# Altium project AP.PrjPcb
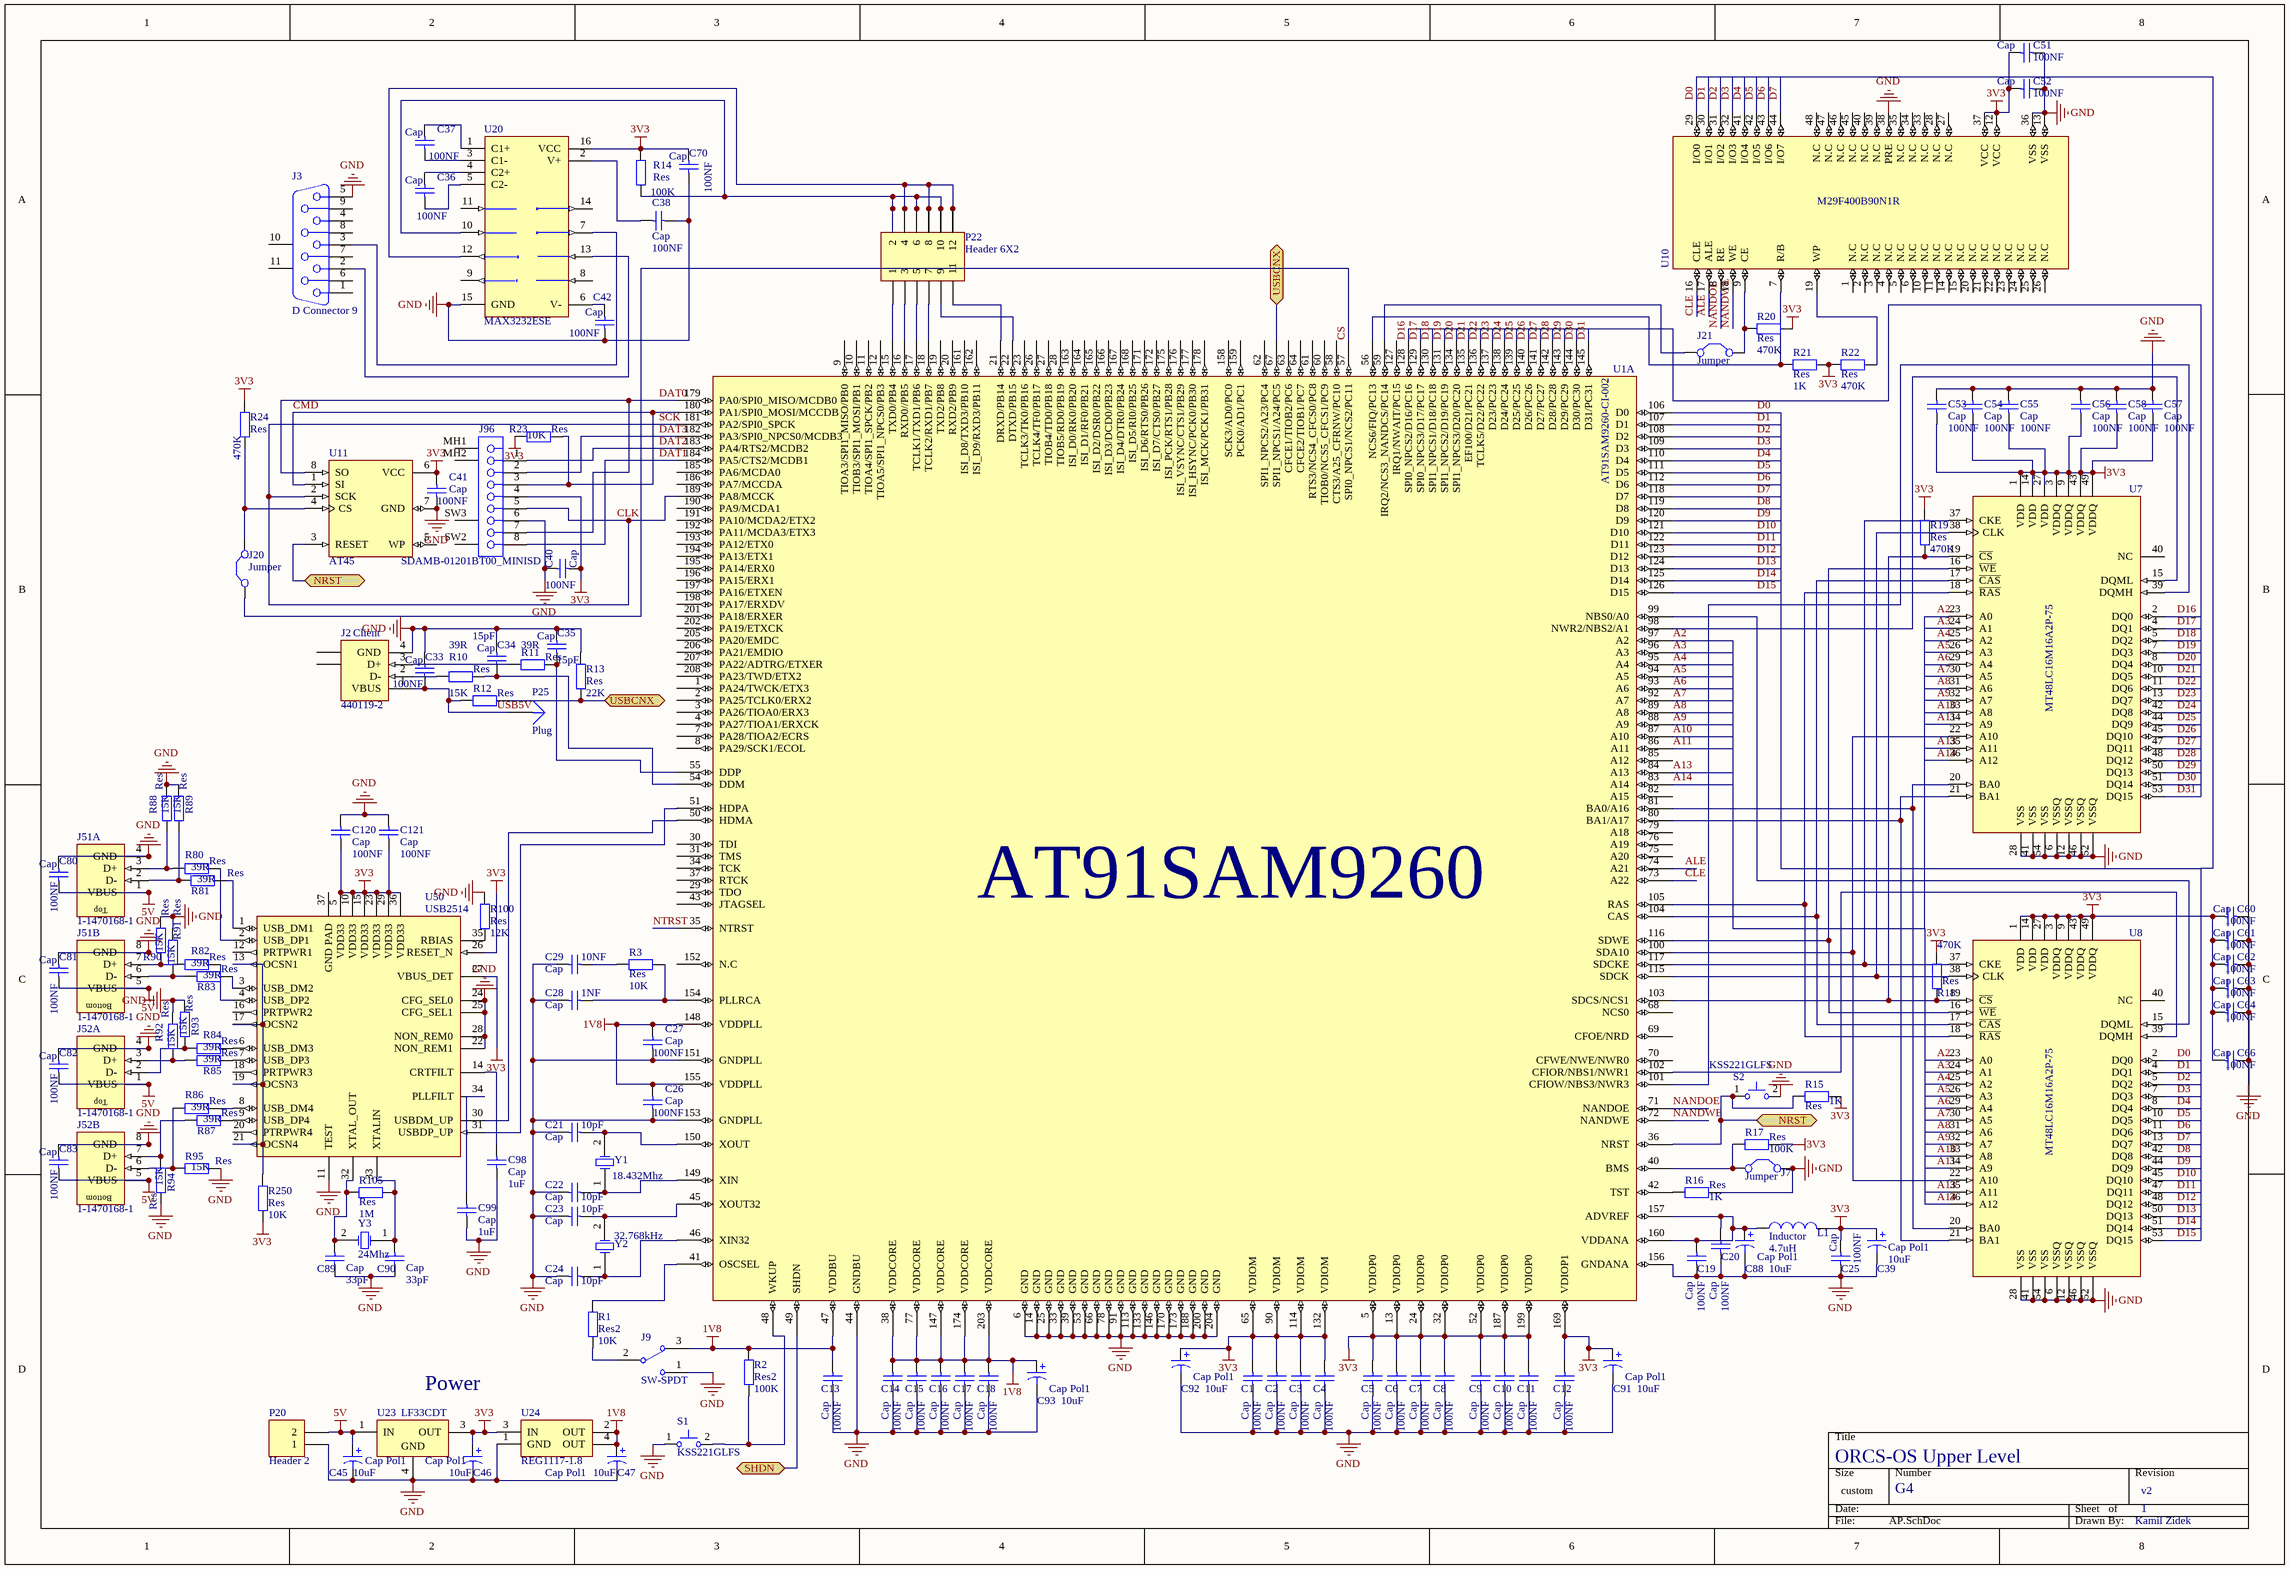
[diagram p0: AP.SchDoc]
1 sheet, 135 parts. Net scope: flat (ports and power ports of the same name join across sheets).
Board file: AP.PcbDoc

## Sheet AP.SchDoc
size 482 x 330 mm; PageSetup: Record=PageOptions|CenterHorizontal=True|CenterVertical=True|PrintScale=2.71|XCorrection=1.00|YCorrection=1.00|PrintKind=1|BorderSize=5000000|LeftOffset=0|BottomOffset=0|Orientation=2|PaperLength=1000|PaperWidth=1000|Scale=100|PaperSource=1|PrintQuality=600|MediaType=1|DitherType=10|PaperKind=Letter|PrintScaleMode=1

### Parts
C1  Cap  value 100NF  [C0805]
C2  Cap  value 100NF  [C0805]
C3  Cap  value 100NF  [C0805]
C4  Cap  value 100NF  [C0805]
C5  Cap  value 100NF  [C0805]
C6  Cap  value 100NF  [C0805]
C7  Cap  value 100NF  [C0805]
C8  Cap  value 100NF  [C0805]
C9  Cap  value 100NF  [C0805]
C10  Cap  value 100NF  [C0805]
C11  Cap  value 100NF  [C0805]
C12  Cap  value 100NF  [C0805]
C13  Cap  value 100NF  [C0805]
C14  Cap  value 100NF  [C0805]
C15  Cap  value 100NF  [C0805]
C16  Cap  value 100NF  [C0805]
C17  Cap  value 100NF  [C0805]
C18  Cap  value 100NF  [C0805]
C19  Cap  value 100NF  [C0805]
C20  Cap  value 100NF  [C0805]
C21  Cap  value 10pF  [C0805]
C22  Cap  value 10pF  [C0805]
C23  Cap  value 10pF  [C0805]
C24  Cap  value 10pF  [C0805]
C25  Cap  value 100NF  [C0805]
C26  Cap  value 100NF  [C0805]
C27  Cap  value 100NF  [C0805]
C28  Cap  value 1NF  [C0805]
C29  Cap  value 10NF  [C0805]
C33  Cap  value 100NF  [C0805]
C34  Cap  value 15pF  [C0805]
C35  Cap  value 15pF  [C0805]
C36  Cap  value 100NF  [C0805]
C37  Cap  value 100NF  [C0805]
C38  Cap  value 100NF  [C0805]
C39  Cap Pol1  value 10uF  [A]
C40  Cap  value 100NF  [C0805]
C41  Cap  value 100NF  [C0805]
C42  Cap  value 100NF  [C0805]
C45  Cap Pol1  value 10uF  [A]
C46  Cap Pol1  value 10uF  [A]
C47  Cap Pol1  value 10uF  [A]
C51  Cap  value 100NF  [C0805]
C52  Cap  value 100NF  [C0805]
C53  Cap  value 100NF  [C0805]
C54  Cap  value 100NF  [C0805]
C55  Cap  value 100NF  [C0805]
C56  Cap  value 100NF  [C0805]
C57  Cap  value 100NF  [C0805]
C58  Cap  value 100NF  [C0805]
C60  Cap  value 100NF  [C0805]
C61  Cap  value 100NF  [C0805]
C62  Cap  value 100NF  [C0805]
C63  Cap  value 100NF  [C0805]
C64  Cap  value 100NF  [C0805]
C66  Cap  value 100NF  [C0805]
C70  Cap  value 100NF  [C0805]
C80  Cap  value 100NF  [C0805]
C81  Cap  value 100NF  [C0805]
C82  Cap  value 100NF  [C0805]
C83  Cap  value 100NF  [C0805]
C88  Cap Pol1  value 10uF  [A]
C89  Cap  value 33pF  [C0805]
C90  Cap  value 33pF  [C0805]
C91  Cap Pol1  value 10uF  [A]
C92  Cap Pol1  value 10uF  [A]
C93  Cap Pol1  value 10uF  [A]
C98  Cap  value 1uF  [C0805]
C99  Cap  value 1uF  [C0805]
C120  Cap  value 100NF  [C0805]
C121  Cap  value 100NF  [C0805]
J2  440119-2  [440247]
J3  D Connector 9  [DSUB1.385-2H9]
J7  Jumper  [RAD-0.2]
J9  SW-SPDT  [TL36WW15050]
J20  Jumper  [RAD-0.2]
J21  Jumper  [RAD-0.2]
J51  1-1470168-1  [1470168]  (parts A,B of 3)
J52  1-1470168-1  [1470168]  (parts A,B of 3)
J96  SDAMB-01201BT00_MINISD  [SDAMB-012_miniSD]
L1  Inductor  value 4.7uH  [0402-A]
P20  Header 2  [HDR1X2]
P22  Header 6X2  [HDR2X6]
P25  Plug  [PIN1]
R1  Res2  value 10K  [2012[0805]]
R2  Res2  value 100K  [2012[0805]]
R3  Res  value 10K  [2012[0805]]
R10  Res  value 39R  [2012[0805]]
R11  Res  value 39R  [2012[0805]]
R12  Res  value 15K  [2012[0805]]
R13  Res  value 22K  [2012[0805]]
R14  Res  value 100K  [2012[0805]]
R15  Res  value 1K  [2012[0805]]
R16  Res  value 1K  [2012[0805]]
R17  Res  value 100K  [2012[0805]]
R18  Res  value 470K  [2012[0805]]
R19  Res  value 470K  [2012[0805]]
R20  Res  value 470K  [2012[0805]]
R21  Res  value 1K  [2012[0805]]
R22  Res  value 470K  [2012[0805]]
R23  Res  value 10K  [2012[0805]]
R24  Res  value 470K  [2012[0805]]
R80  Res  value 39R  [2012[0805]]
R81  Res  value 39R  [2012[0805]]
R82  Res  value 39R  [2012[0805]]
R83  Res  value 39R  [2012[0805]]
R84  Res  value 39R  [2012[0805]]
R85  Res  value 39R  [2012[0805]]
R86  Res  value 39R  [2012[0805]]
R87  Res  value 39R  [2012[0805]]
R88  Res  value 15K  [2012[0805]]
R89  Res  value 15K  [2012[0805]]
R90  Res  value 15K  [2012[0805]]
R91  Res  value 15K  [2012[0805]]
R92  Res  value 15K  [2012[0805]]
R93  Res  value 15K  [2012[0805]]
R94  Res  value 15K  [2012[0805]]
R95  Res  value 15K  [2012[0805]]
R100  Res  value 12K  [2012[0805]]
R105  Res  value 1M  [2012[0805]]
R250  Res  value 10K  [2012[0805]]
S1  KSS221GLFS  [KSS-2G]
S2  KSS221GLFS  [KSS-2G]
U1  AT91SAM9260-CI-002  [QFP208_M]  (part A of 3)
U7  MT48LC16M16A2P-75  [TSOP2-54_L]
U8  MT48LC16M16A2P-75  [TSOP2-54_L]
U10  M29F400B90N1R  [TSOP48]
U11  AT45  [SO8W_N]
U20  MAX3232ESE  [NSO16_N]
U23  LF33CDT  [TO-252]
U24  REG1117-1.8  [ZZ311]
U50  USB2514  [QFN36_L]
Y1  18.432Mhz  [HC-49U]
Y2  32.768kHz  [R38]
Y3  24Mhz  [HC-49U]

### Ports
NRST, SHDN, USBCNX

### Nets
1V8: C13.2 C14.2 C15.2 C16.2 C17.2 C18.2 C26.1 C27.1 C47.1 C93.1 J9.3 R2.2 U1.38(VDDCORE) U1.47(VDDBU) U1.77(VDDCORE) U1.147(VDDCORE) U1.148(VDDPLL) U1.155(VDDPLL) U1.174(VDDCORE) U1.203(VDDCORE) U24.2(OUT) U24.4(OUT)
3V3: C1.2 C2.2 C3.2 C4.2 C5.2 C6.2 C7.2 C8.2 C9.2 C10.2 C11.2 C12.2 C25.2 C39.1 C40.1 C41.1 C46.1 C51.2 C52.2 C53.2 C54.2 C55.2 C56.2 C57.2 C58.2 C60.1 C61.1 C62.1 C63.1 C64.1 C66.1 C70.2 C91.1 C92.1 C120.1 C121.2 J96.4 L1.2 R14.2 R15.1 R17.1 R18.1 R19.1 R20.2 R21.2 R22.1 R23.2 R24.1 R250.2 U1.5(VDIOP0) U1.13(VDIOP0) U1.24(VDIOP0) U1.32(VDIOP0) U1.52(VDIOP0) U1.65(VDIOM) U1.90(VDIOM) U1.114(VDIOM) U1.132(VDIOM) U1.169(VDIOP1) U1.187(VDIOP0) U1.199(VDIOP0) U7.1(VDD) U7.3(VDDQ) U7.9(VDDQ) U7.14(VDD) U7.27(VDD) U7.43(VDDQ) U7.49(VDDQ) U8.1(VDD) U8.3(VDDQ) U8.9(VDDQ) U8.14(VDD) U8.27(VDD) U8.43(VDDQ) U8.49(VDDQ) U10.12(VCC) U10.37(VCC) U11.6(VCC) U20.16(VCC) U23.3(OUT) U24.3(IN) U50.5(VDD33) U50.10(VDD33) U50.15(VDD33) U50.23(VDD33) U50.26(RESET_N) U50.27(VBUS_DET) U50.29(VDD33) U50.36(VDD33)
5V: C45.1 C80.1 C81.1 C82.1 C83.1 J51.1(VBUS) J51.5(VBUS) J52.1(VBUS) J52.5(VBUS) P20.2 U23.1(IN)
GND: C1.1 C2.1 C3.1 C4.1 C5.1 C6.1 C7.1 C8.1 C9.1 C10.1 C11.1 C12.1 C13.1 C14.1 C15.1 C16.1 C17.1 C18.1 C19.1 C20.1 C21.2 C22.2 C23.2 C24.2 C25.1 C26.2 C27.2 C28.2 C29.2 C33.2 C34.2 C35.2 C38.1 C39.2 C40.2 C41.2 C42.1 C45.2 C46.2 C47.2 C51.1 C52.1 C53.1 C54.1 C55.1 C56.1 C57.1 C58.1 C60.2 C61.2 C62.2 C63.2 C64.2 C66.2 C70.1 C80.2 C81.2 C82.2 C83.2 C88.2 C89.2 C90.2 C91.2 C92.2 C93.2 C98.2 C99.2 C120.2 C121.1 J2.4(GND) J3.5 J7.2(C2) J9.1 J51.4(GND) J51.8(GND) J52.4(GND) J52.8(GND) J96.6 P20.1 R13.2 R16.1 R88.2 R89.1 R90.2 R91.2 R92.2 R93.2 R94.1 R95.1 R100.2 S1.1 S2.2 U1.6(GND) U1.14(GND) U1.25(GND) U1.33(GND) U1.39(GND) U1.44(GNDBU) U1.53(GND) U1.66(GND) U1.78(GND) U1.91(GND) U1.113(GND) U1.133(GND) U1.146(GND) U1.151(GNDPLL) U1.153(GNDPLL) U1.156(GNDANA) U1.170(GND) U1.173(GND) U1.188(GND) U1.200(GND) U1.204(GND) U7.6(VSSQ) U7.12(VSSQ) U7.28(VSS) U7.41(VSS) U7.46(VSSQ) U7.52(VSSQ) U7.54(VSS) U8.6(VSSQ) U8.12(VSSQ) U8.28(VSS) U8.41(VSS) U8.46(VSSQ) U8.52(VSSQ) U8.54(VSS) U10.13(VSS) U10.36(VSS) U10.38(PRE) U11.7(GND) U20.15(GND) U23.4(GND) U24.1(GND) U50.11(TEST) U50.22(NON_REM1) U50.24(CFG_SEL0) U50.25(CFG_SEL1) U50.28(NON_REM0)
A2: U1.97(A2) U7.23(A0) U8.23(A0)
A3: U1.96(A3) U7.24(A1) U8.24(A1)
A4: U1.95(A4) U7.25(A2) U8.25(A2)
A5: U1.94(A5) U7.26(A3) U8.26(A3)
A6: U1.93(A6) U7.29(A4) U8.29(A4)
A7: U1.92(A7) U7.30(A5) U8.30(A5)
A8: U1.89(A8) U7.31(A6) U8.31(A6)
A9: U1.88(A9) U7.32(A7) U8.32(A7)
A10: U1.87(A10) U7.33(A8) U8.33(A8)
A11: U1.86(A11) U7.34(A9) U8.34(A9)
A13: U1.84(A13) U7.35(A11) U8.35(A11)
A14: U1.83(A14) U7.36(A12) U8.36(A12)
ALE: U1.74(A21) U10.17(ALE)
CLE: U1.73(A22) U10.16(CLE)
CLK: J96.5 U1.181(PA2/SPI0_SPCK) U1.189(PA8/MCCK) U11.2(SCK)  [also labelled SCK]
CMD: J96.3 R23.1 U1.180(PA1/SPI0_MOSI/MCCDB) U11.1(SI)
CS: J20.1(C1) U1.57(SPI0_NPCS1/NCS2/PC11)
D0: U1.106(D0) U8.2(DQ0) U10.29(I/O0)
D1: U1.107(D1) U8.4(DQ1) U10.30(I/O1)
D2: U1.108(D2) U8.5(DQ2) U10.31(I/O2)
D3: U1.109(D3) U8.7(DQ3) U10.32(I/O3)
D4: U1.110(D4) U8.8(DQ4) U10.41(I/O4)
D5: U1.111(D5) U8.10(DQ5) U10.42(I/O5)
D6: U1.112(D6) U8.11(DQ6) U10.43(I/O6)
D7: U1.118(D7) U8.13(DQ7) U10.44(I/O7)
D8: U1.119(D8) U8.42(DQ8)
D9: U1.120(D9) U8.44(DQ9)
D10: U1.121(D10) U8.45(DQ10)
D11: U1.122(D11) U8.47(DQ11)
D12: U1.123(D12) U8.48(DQ12)
D13: U1.124(D13) U8.50(DQ13)
D14: U1.125(D14) U8.51(DQ14)
D15: U1.126(D15) U8.53(DQ15)
D16: U1.128(SPI0_NPCS2/D16/PC16) U7.2(DQ0)
D17: U1.129(SPI0_NPCS3/D17/PC17) U7.4(DQ1)
D18: U1.130(SPI1_NPCS1/D18/PC18) U7.5(DQ2)
D19: U1.131(SPI1_NPCS2/D19/PC19) U7.7(DQ3)
D20: U1.134(SPI1_NPCS3/D20/PC20) U7.8(DQ4)
D21: U1.135(EF100/D21/PC21) U7.10(DQ5)
D22: U1.136(TCLK5/D22/PC22) U7.11(DQ6)
D23: U1.137(D23/PC23) U7.13(DQ7)
D24: U1.138(D24/PC24) U7.42(DQ8)
D25: U1.139(D25/PC25) U7.44(DQ9)
D26: U1.140(D26/PC26) U7.45(DQ10)
D27: U1.141(D27/PC27) U7.47(DQ11)
D28: U1.142(D28/PC28) U7.48(DQ12)
D29: U1.143(D29/PC29) U7.50(DQ13)
D30: U1.144(D30/PC30) U7.51(DQ14)
D31: U1.145(D31/PC31) U7.53(DQ15)
DAT0: J96.7 U1.179(PA0/SPI0_MISO/MCDB0) U11.8(SO)
DAT1: J96.8 U1.184(PA5/CTS2/MCDB1)
DAT2: J96.1 U1.183(PA4/RTS2/MCDB2)
DAT3: J96.2 U1.182(PA3/SPI0_NPCS0/MCDB3)
NANDOE: U1.71(NANDOE) U10.8(RE)
NANDWE: U1.72(NANDWE) U10.18(WE)
NTRST: U1.35(NTRST)
USB5V: C33.1 J2.1(VBUS) P25.1 R12.2
NetC19_2: C19.2 C20.2 C88.1 L1.1 U1.157(ADVREF) U1.160(VDDANA)
NetC21_1: C21.1 U1.150(XOUT) Y1.2(OSC2)
NetC22_1: C22.1 U1.149(XIN) Y1.1(OSC1)
NetC23_1: C23.1 U1.45(XOUT32) Y2.2(OSC2)
NetC24_1: C24.1 U1.46(XIN32) Y2.1(OSC1)
NetC28_1: C28.1 R3.1 U1.154(PLLRCA)
NetC29_1: C29.1 R3.2
NetC34_1: C34.1 R10.1 U1.54(DDM)
NetC35_1: C35.1 R11.1 U1.55(DDP)
NetC36_1: C36.1 U20.5(C2-)
NetC36_2: C36.2 U20.4(C2+)
NetC37_1: C37.1 U20.3(C1-)
NetC37_2: C37.2 U20.1(C1+)
NetC38_2: C38.2 U20.2(V+)
NetC42_2: C42.2 U20.6(V-)
NetC89_1: C89.1 R105.2 U50.32(XTAL_OUT) Y3.2(OSC2)
NetC90_1: C90.1 R105.1 U50.33(XTALIN) Y3.1(OSC1)
NetC98_1: C98.1 U50.14(CRTFILT)
NetC99_1: C99.1 U50.34(PLLFILT)
NetJ2_2: J2.2(D-) R10.2
NetJ2_3: J2.3(D+) R11.2
NetJ3_2: J3.2 U20.13(R1IN)
NetJ3_3: J3.3 U20.7(T2OUT)
NetJ7_1: J7.1(C1) R17.2 U1.40(BMS)
NetJ9_2: J9.2 R1.1
NetJ20_2: J20.2(C2) R24.2 U11.4(CS)
NetJ21_1: J21.1(C1) U1.59(IRQ2/NCS3_NANDCS/PC14)
NetJ21_2: J21.2(C2) R20.1 U10.9(CE)
NetJ51_2: J51.2(D-) R81.2 R89.2
NetJ51_3: J51.3(D+) R80.2 R88.1
NetJ51_6: J51.6(D-) R83.2 R90.1
NetJ51_7: J51.7(D+) R82.2 R91.1
NetJ52_2: J52.2(D-) R84.2 R93.1
NetJ52_3: J52.3(D+) R85.2 R92.1
NetJ52_6: J52.6(D-) R86.2 R95.2
NetJ52_7: J52.7(D+) R87.2 R94.2
NetP22_1: P22.1 U1.15(TXD0/PB4)
NetP22_2: P22.2 P22.6 P22.10 R14.1 U20.10(T2IN)
NetP22_3: P22.3 U1.16(RXD0//PB5)
NetP22_4: P22.4 P22.8 P22.12 U20.12(R1OUT)
NetP22_5: P22.5 U1.17(TCLK1/TXD1/PB6)
NetP22_7: P22.7 U1.18(TCLK2/RXD1/PB7)
NetP22_9: P22.9 U1.22(DTXD/PB15)
NetP22_11: P22.11 U1.21(DRXD/PB14)
NetR1_2: R1.2 U1.41(OSCSEL)
NetR2_1: R2.1 S1.2 U1.48(WKUP)
NetR12_1: R12.1 R13.1 U1.67(SPI1_NPCS1/A24/PC5) ; port USBCNX
NetR15_2: R15.2 S2.1 U1.36(NRST) U11.3(RESET) ; port NRST
NetR16_2: R16.2 U1.42(TST)
NetR18_2: R18.2 R19.2 U1.103(SDCS/NCS1) U7.19(~{CS}) U8.19(~{CS})
NetR21_1: R21.1 U1.56(NCS6/FIQ/PC13) U10.7(R/B)
NetR22_2: R22.2 U10.19(WP)
NetR80_1: R80.1 U50.2(USB_DP1)
NetR81_1: R81.1 U50.1(USB_DM1)
NetR82_1: R82.1 U50.4(USB_DP2)
NetR83_1: R83.1 U50.3(USB_DM2)
NetR84_1: R84.1 U50.6(USB_DM3)
NetR85_1: R85.1 U50.7(USB_DP3)
NetR86_1: R86.1 U50.8(USB_DM4)
NetR87_1: R87.1 U50.9(USB_DP4)
NetR100_1: R100.1 U50.35(RBIAS)
NetR250_1: R250.1 U50.13(OCSN1) U50.17(OCSN2) U50.19(OCSN3) U50.21(OCSN4)
NetU1_49: U1.49(SHDN) ; port SHDN
NetU1_50: U1.50(HDMA) U50.30(USBDM_UP)
NetU1_51: U1.51(HDPA) U50.31(USBDP_UP)
NetU1_80: U1.80(BA1/A17) U7.21(BA1) U8.21(BA1)
NetU1_81: U1.81(BA0/A16) U7.20(BA0) U8.20(BA0)
NetU1_98: U1.98(NWR2/NBS2/A1) U7.15(DQML)
NetU1_99: U1.99(NBS0/A0) U8.15(DQML)
NetU1_100: U1.100(SDA10) U7.22(A10) U8.22(A10)
NetU1_101: U1.101(CFIOW/NBS3/NWR3) U7.39(DQMH)
NetU1_102: U1.102(CFIOR/NBS1/NWR1) U8.39(DQMH)
NetU1_104: U1.104(CAS) U7.17(~{CAS}) U8.17(~{CAS})
NetU1_105: U1.105(RAS) U7.18(~{RAS}) U8.18(~{RAS})
NetU1_115: U1.115(SDCK) U7.38(CLK) U8.38(CLK)
NetU1_116: U1.116(SDWE) U7.16(~{WE}) U8.16(~{WE})
NetU1_117: U1.117(SDCKE) U7.37(CKE) U8.37(CKE)

Not connected (* = marked no-connect by the designer): J2 5(SHLD) 6(SHLD); J3 1 4 6 7 8 9 10(MH1) 11(MH2); J96 MH1 MH2 SW2 SW3; U1 1(PA24/TWCK/ETX3) 2(PA25/TCLK0/ERX2) 3(PA26/TIOA0/ERX3) 4(PA27/TIOA1/ERXCK) 7(PA28/TIOA2/ECRS) 8(PA29/SCK1/ECOL) 9(TIOA3/SPI1_MISO/PB0) 10(TIOB3/SPI1_MOSI/PB1) 11(TIOA4/SPI1_SPCK/PB2) 12(TIOA5/SPI1_NPCS0/PB3) 19(TXD2/PB8) 20(RXD2/PB9) 23(TCLK3/TK0/PB16) 26(TCLK4/TF0/PB17) 27(TIOB4/TD0/PB18) 28(TIOB5/RD0/PB19) 29(TDO) 30(TDI) 31(TMS) 34(TCK) 37(RTCK) 43(JTAGSEL) 58(CTS3/A25_CFRNW/PC10) 60(TIOB0/NCS5_CFCS1/PC9) 61(RTS3/NCS4_CFCS0/PC8) 62(SPI1_NPCS2/A23/PC4) 63(CFCE1/TIOB2/PC6) 64(CFCE2/TIOB1/PC7) 68(NCS0) 69(CFOE/NRD) 70(CFWE/NWE/NWR0) 75(A20) 76(A19) 79(A18) 82(A15) 85(A12) 127(IRQ1/NWAIT/PC15) 152(N.C) 158(SCK3/AD0/PC0) 159(PCK0/AD1/PC1) 161(ISI_D8/TXD3/PB10) 162(ISI_D9/RXD3/PB11) 163(ISI_D0/RK0/PB20) 164(ISI_D1/RF0/PB21) 165(ISI_D2/DSR0/PB22) 166(ISI_D3/DCD0/PB23) 167(ISI_D4/DTR0/PB24) 168(ISI_D5/RI0/PB25) 171(ISI_D6/RTS0/PB26) 172(ISI_D7/CTS0/PB27) 175(ISI_PCK/RTS1/PB28) 176(ISI_VSYNC/CTS1/PB29) 177(ISI_HSYNC/PCK0/PB30) 178(ISI_MCK/PCK1/PB31) 185(PA6/MCDA0) 186(PA7/MCCDA) 190(PA9/MCDA1) 191(PA10/MCDA2/ETX2) 192(PA11/MCDA3/ETX3) 193(PA12/ETX0) 194(PA13/ETX1) 195(PA14/ERX0) 196(PA15/ERX1) 197(PA16/ETXEN) 198(PA17/ERXDV) 201(PA18/ERXER) 202(PA19/ETXCK) 205(PA20/EMDC) 206(PA21/EMDIO) 207(PA22/ADTRG/ETXER) 208(PA23/TWD/ETX2); U7 40(NC); U8 40(NC); U10 1(N.C) 2(N.C) 3(N.C) 4(N.C) 5(N.C) 6(N.C) 10(N.C) 11(N.C) 14(N.C) 15(N.C) 20(N.C) 21(N.C) 22(N.C) 23(N.C) 24(N.C) 25(N.C) 26(N.C) 27(N.C) 28(N.C) 33(N.C) 34(N.C) 35(N.C) 39(N.C) 40(N.C) 45(N.C) 46(N.C) 47(N.C) 48(N.C); U11 5(WP); U20 8(R2IN) 9(R2OUT) 11(T1IN) 14(T1OUT); U50 12(PRTPWR1) 16(PRTPWR2) 18(PRTPWR3) 20(PTRPWR4) 37(GND_PAD)

### Notes on the sheet
- (near J2) Client
- Power
- ORCS-OS Upper Level
- G4
- Kamil Zidek
- 1
- v2
- (in symbol 1-1470168-1, part A) Top
- (in symbol 1-1470168-1, part B) Bottom
- (in symbol AT91RM9200-CI-002, part A) AT91SAM9260

### Library data of the parts
C1-C29 C33-C38 C40-C42 C51-C58 C60-C64 C66 C70 C80-C83 C89 C90 C98 C99 C120 C121 = Cap Semi: Capacitor (Semiconductor SIM Model); Published: 8-Jun-2000; LatestRevisionDate: 17-Jul-2002; LatestRevisionNote: Re-released for DXP Platform.; PackageReference: C1206; Publisher: Altium Limited
C39 C45-C47 C88 C91-C93 = Cap Pol1: Polarized Capacitor (Radial); Published: 8-Jun-2000; LatestRevisionDate: 17-Jul-2002; LatestRevisionNote: Re-released for DXP Platform.; PackageReference: RB7.6-15; Publisher: Altium Limited
J2 = 440119-2: USB 1.1, Right Angle, Thru-Hole, B Type, Receptacle, 4 Position, Black; ContactMaterial: Copper Alloy; ContactPlating: Gold Flash over Nickel; TerminationLength: 2.84mm [0.112in.]; PCB_Layout: Complies with manufacturer's recommendation.; DrillSize: Corresponds to nominal value.; PanelGround: Without; Published: 15-Jul-2004; DatasheetDocument: 12-Jan-2004; PackageDocument: 12-Jan-2004; PackageReference: 440119; Publisher: Altium Limited; HousingMaterial: Thermoplastic; ComponentLink1Description: Manufacturer Link; ComponentLink1URL: http://www.tycoelectronics.com/; ComponentLink2Description: Packaging Specification; ComponentLink2URL: http://ecommas.tycoelectronics.com/commerce/DocumentDelivery/DDEController?Action=showdoc&DocId=Customer+Drawing%7F440119%7FC%7Ftif%7FEnglish%7FC_440119_C.tif
J3 = D Connector 9: Receptacle Assembly, 9 Position, Right Angle; PackageDocument: O; Positions: 9; Published: 15-Jun-2001; LatestRevisionDate: 17-Jul-2002; LatestRevisionNote: Re-released for DXP Platform.; DatasheetDocument: 1-Sep-1999; PackageReference: 788750; Publisher: Altium Limited; Orientation: Right Angle; Gender: Receptacle
J7 J20 J21 = Jumper: Jumper Wire; Published: 24-Mar-1999; LatestRevisionDate: 17-Jul-2002; LatestRevisionNote: Re-released for DXP Platform.; PackageReference: RAD-0.2; Publisher: Altium Limited
J9 = SW-SPDT: SPDT Subminiature Toggle Switch, Right Angle Mounting, Vertical Actuation; Published: 24-Mar-1999; LatestRevisionDate: 17-Dec-2003; LatestRevisionNote: Schematic revised, PCB Footprint replaced.; DatasheetDocument: 05-Dec-2000; PackageReference: TL36WW15050; Publisher: Altium Limited; ComponentLink1Description: Manufacturer Link; ComponentLink1URL: http://www.apem.com
J51 J52 = 1-1470168-1: USB 1.1, Right Angle, Thru-Hole, A Type, Receptacle, 4x4 Position, Stacked, Black; ContactMaterial: Copper Alloy; ContactPlating: Gold Flash; TerminationLength: 3.18mm [0.125in.]; PCB_Layout: Complies with manufacturer's recommendation.; DrillSize: Corresponds to nominal value.; PanelGround: With; Published: 15-Jul-2004; DatasheetDocument: 15-Aug-2002; PackageDocument: 15-Aug-2002; PackageReference: 1470168; Publisher: Altium Limited; HousingMaterial: Glass-Filled Thermoplastic; ComponentLink1Description: Manufacturer Link; ComponentLink1URL: http://www.tycoelectronics.com/; ComponentLink2Description: Packaging Specification; ComponentLink2URL: http://ecommas.tycoelectronics.com/commerce/DocumentDelivery/DDEController?Action=showdoc&DocId=Customer+Drawing%7F1470168%7FA%7Fpdf%7FEnglish%7FC_1470168_A.pdf
J96 = SDAMB-01201BT00_MINISD: Secure Digital Card Connector, Type A without Cover; Surface Mount; 9-Position, 1u" Au Plating; PCB_Layout: Complies with manufacturer's recommendation.; Note: SD and MMC full compatible; Published: 21-Sep-2007; DatasheetVersion: rev.I, 2006; PackageVersion: 2006; PackageReference: SDAMB-012_miniSD; Publisher: Altium Limited; PackageDescription: SD Card without Cover, SM, 9 Position, Right Angle, Body 23.3 x 27.4 x 3.4 mm (LxWxH); ComponentLink1Description: Manufacturer Link; ComponentLink1URL: http://www.kingfont.com/; ComponentLink2Description: Datasheet; ComponentLink2URL: http://php2.twinner.com.tw/files/kingfont/SDAMB-012XXBXXX-1C.pdf
L1 = Inductor: Code_IEC: 1005; Published: 8-Jun-2000; LatestRevisionDate: 17-Jul-2002; LatestRevisionNote: Re-released for DXP Platform.; PackageReference: 0402-A; Publisher: Altium Limited; Code_JEITA: 0402
P20 = Header 2: Header, 2-Pin; LatestRevisionDate: 17-Jul-2002; LatestRevisionNote: Re-released for DXP Platform.; Publisher: Altium Limited
P22 = Header 6X2: Header, 6-Pin, Dual row; LatestRevisionDate: 17-Jul-2002; LatestRevisionNote: Re-released for DXP Platform.; Publisher: Altium Limited
R1-R3 R10-R24 R80-R95 R100 R105 R250 = Res2: Resistor; Published: 8-Jun-2000; LatestRevisionDate: 17-Jul-2002; LatestRevisionNote: Re-released for DXP Platform.; PackageReference: AXIAL-0.4; Publisher: Altium Limited
S1 S2 = KSS221GLFS: Switch, Subminiature Side-Actuated Tact, SMT, KSS Series, Std Actuator, 2 Gull Wing Leads, SPST, 2N Force, Silver Contact; PCB_Layout: Complies with manufacturer's recommendation.; Published: 14-Mar-2008; DatasheetVersion: Aug-2007; PackageVersion: Aug-2007; PackageReference: KSS-2G; Publisher: Altium Limited; PackageDescription: Subminiature SMT Side Actuated Switch, Body 7 x 3.5 mm (LxW); ComponentLink1Description: Manufacturer Link; ComponentLink1URL: http://www.ck-components.com/; ComponentLink2Description: Datasheet; ComponentLink2URL: http://www.ck-components.com/media/pdf/catalogs/Tactile_Switches%5CKSS_series_Tactile_August_2007.pdf
U1 = AT91RM9200-CI-002: 16-Bit ARM Microcontroller, ARM9TDMI 32-bit RISC CPU, 16KB Instruction and 16KB Data caches, 256-Ball BGA, Industrial; pin to pad: A1>61 A2>62 A7>1 A11>2 A14>3 A16>4 B1>63 B7>5 B11>6 C1>64 C11>7 C14>24 C15>8 D1>65 D2>9 D3>10 D4>11 D5>12 D8>13 D11>14 E1>66 E2>67 E3>15 E4>68 E5>69 E6>16 E8>17 F2>18 F6>25 F17>70 G3>19 G17>71 H5>20 H13>26 H14>21 H15>27 H16>22 H17>72 J12>23 J13>28 J14>29 J15>30 J16>31 J17>73 K1>94 K2>74 K3>95 K4>32 K5>75 K16>33 K17>76 L1>34 L2>96 L3>97 L4>98 L5>35 L6>36 L16>37 L17>77 M1>38 M2>39 M3>99 M4>100 M5>101 M6>102 M7>40 M9>103 M11>78 M12>41 M16>42 N1>104 N2>105 N3>106 N4>107 N5>108 N6>109 N7>110 N8>111 N9>112 N10>113 N11>79 N12>43 P1>114 P2>115 P3>116 P4>44 P5>117 P6>118 P8>119 P9>120 P10>80 P11>81 P12>82 P13>83 P16>45 P17>46 R1>47 R2>48 R3>121 R4>122 R6>49 R7>123 R8>124 R9>84 R10>50 R11>85 R12>86 R14>51 R17>52 T1>125 T2>53 T3>126 T5>54 T6>127 T7>128 T8>129 T9>55 T10>56 T11>87 T12>88 T13>57 U1>58 U2>59 U3>130 U4>131 U5>60 U6>132 U7>133 U8>134 U9>89 U10>90 U11>91 U12>92 U13>93; Note: The Pin names in [ ] brackets indicate peripheral multiplexing function.; Published: 6-Oct-2005; LatestRevisionDate: 13-Apr-2006; LatestRevisionNote: IPC-7351 Footprint Added.; DatasheetVersion: 1768D-ATARM-11-Jul-05; PackageVersion: Jul-2005; PackageReference: BGA256; Publisher: Altium Limited; PackageDescription: 256-Ball Ball Grid Array 0.8 mm Pitch; Code_JEDEC: MO-205E (Depopulated); ComponentLink1Description: Manufacturer Link; ComponentLink1URL: http://www.atmel.com; ComponentLink2Description: Datasheet; ComponentLink2URL: http://www.atmel.com/dyn/resources/prod_documents/doc1768.pdf
U7 U8 = MT48LC16M16A2P-75: 256Mb Synchronous High-Speed CMOS DRAM, 16Mb x 16Bit x 4 Banks, 54-Pin TSOP Pb-free, Commercial; CycleTime: 7.5ns @ CL = 3 (PC133); RowAddress: 8K (A0-A12); ColumnAddress: 512 (A0-A8); Published: 11-Oct-2004; LatestRevisionDate: 13-Apr-2006; LatestRevisionNote: IPC-7351 Footprint Added.; DatasheetVersion: RevL, Oct-2007; PackageVersion: Sep-2003; PackageReference: TSOP2-54; Publisher: Altium Limited; PackageDescription: 54-Pin Plastic Small Outline Package 0.8 mm Pitch; Code_JEDEC: MS-024-FA; ComponentLink1Description: Manufacturer Link; ComponentLink1URL: http://www.micron.com; ComponentLink2Description: Datasheet; ComponentLink2URL: http://download.micron.com/pdf/datasheets/dram/sdram/256MSDRAM.pdf
U10 = M29F400B90N1R: 4 Mbit (512Kb x8 or 256Kb x16, Boot Block) Single Supply Flash Memory; Published: 24-Aug-2001; LatestRevisionDate: 06-Jun-2005; LatestRevisionNote: Stylized 3D Model Added.; DatasheetVersion: Nov-1999; PackageVersion: Jul-1998; PackageReference: TSOP48; Publisher: Altium Limited; PackageDescription: Shrink Small Outline, Plastic, Thin; 48 Leads; Body Width 18.4 mm; Pitch 0.5 mm; Code_JEDEC: MO-142-DD; ComponentLink1Description: Manufacturer Link; ComponentLink1URL: http://www.st.com/
U11 = AT45: 16Mbit Serial I²C Bus SERIAL FLASH; Published: 24-Aug-2001; LatestRevisionDate: 13-Apr-2006; LatestRevisionNote: IPC-7351 Footprint Added.; DatasheetVersion: Jul-1999; PackageVersion: Aug-1999; PackageReference: SO8W; Publisher: Altium Limited; PackageDescription: 8-Pin Small Outline Package 1.27 mm Pitch; ComponentLink1Description: Manufacturer Link; ComponentLink1URL: http://www.st.com/; ComponentLink2Description: Datasheet; ComponentLink2URL: http://www.st.com/stonline/products/literature/ds/4578/m24c32-w.pdf
U20 = MAX3232ESE: 3.0V TO 5.5V, Low-Power, up to 1Mbps, True RS-232 Transceiver Using Four 0.1µF External Capacitor; Published: 16-Jan-2001; LatestRevisionDate: 13-Apr-2006; LatestRevisionNote: IPC-7351 Footprint Added.; DatasheetVersion: Mar-1999; PackageReference: NSO16; Publisher: Altium Limited; PackageDescription: 16-Pin Small Outline Integrated Circuit 1.27 mm Pitch; Code_JEDEC: MS-012-AC; Code_IPC: SOIC127P600-16; ComponentLink1Description: Manufacturer Link; ComponentLink1URL: http://www.maxim-ic.com/; ComponentLink2Description: Datasheet; ComponentLink2URL: http://pdfserv.maxim-ic.com/en/ds/MAX3222-MAX3241.pdf
U23 = LF33CDT: 500mA, Very Low Drop (0.45V) Voltage Regulator; Published: 24-Aug-2001; LatestRevisionDate: 06-Jun-2005; LatestRevisionNote: PCB pads lengthened.; DatasheetVersion: Feb-2004; PackageVersion: Jun-2004; PackageReference: TO-252; Publisher: Altium Limited; PackageDescription: D-PAK/TO-252-AA; 3 Leads (1 Cropped); Body 10.1 (inc. leads) x 6.6 mm (LxW max); ComponentLink1Description: Manufacturer Link; ComponentLink1URL: http://www.st.com/; ComponentLink2Description: Datasheet; ComponentLink2URL: http://www.st.com/stonline/books/pdf/docs/2574.pdf
U24 = REG1117-2.85: 800mA and 1A Low Dropout Positive Regulator 2.85V, 3.3V, 5V, and Adjustable; Published: 8-Jun-2000; LatestRevisionDate: 17-Jul-2002; LatestRevisionNote: Re-released for DXP Platform.; DatasheetVersion: Sep-1997; PackageVersion: revC; PackageReference: ZZ311; Publisher: Altium Limited; PackageDescription: SOT-223/SC-73; 4 Leads; Body 6.7 x 7.3 mm, inc. leads (LxW max); ComponentLink1Description: Manufacturer Link; ComponentLink1URL: http://www.ti.com/; ComponentLink2Description: Datasheet; ComponentLink2URL: http://www-s.ti.com/sc/ds/REG1117.pdf
U50 = USB2514: USB UART Asynchronous Serial Data Transfer Chip, QFN32, Pb-Free; Published: 6-Oct-2005; LatestRevisionDate: 13-Apr-2006; LatestRevisionNote: IPC-7351 Footprint Added.; DatasheetVersion: ver 1.7, Feb-2005; PackageVersion: Feb-2005; PackageReference: QFN36; Publisher: Altium Limited; PackageDescription: 36-Pin Quad Flat No-Lead 0.5 mm Pitch; ComponentLink1Description: Manufacturer Link; ComponentLink1URL: http://www.ftdichip.com/Products/FT232BM.htm; ComponentLink2Description: Datasheet; ComponentLink2URL: http://www.ftdichip.com/Documents/DataSheets/ds232bq17.pdf
Y1-Y3 = ECS-10-13-1: Crystal Oscillator; Published: 17-Jul-2002; DatasheetDocument: 18-Apr-2000; PackageReference: HC-49U; Publisher: Altium Limited; ComponentLink1Description: Manufacturer Link; ComponentLink1URL: http://www.ecsxtal.com/; ComponentLink2Description: Datasheet; ComponentLink2URL: http://www.ecsxtal.com/pdf2/HC49U.PDF
P25 = Plug: LatestRevisionDate: 17-Jul-2002; LatestRevisionNote: Re-released for DXP Platform.; Publisher: Altium Limited